# Altium schematic sheet MotorCell.SchDoc
size A3
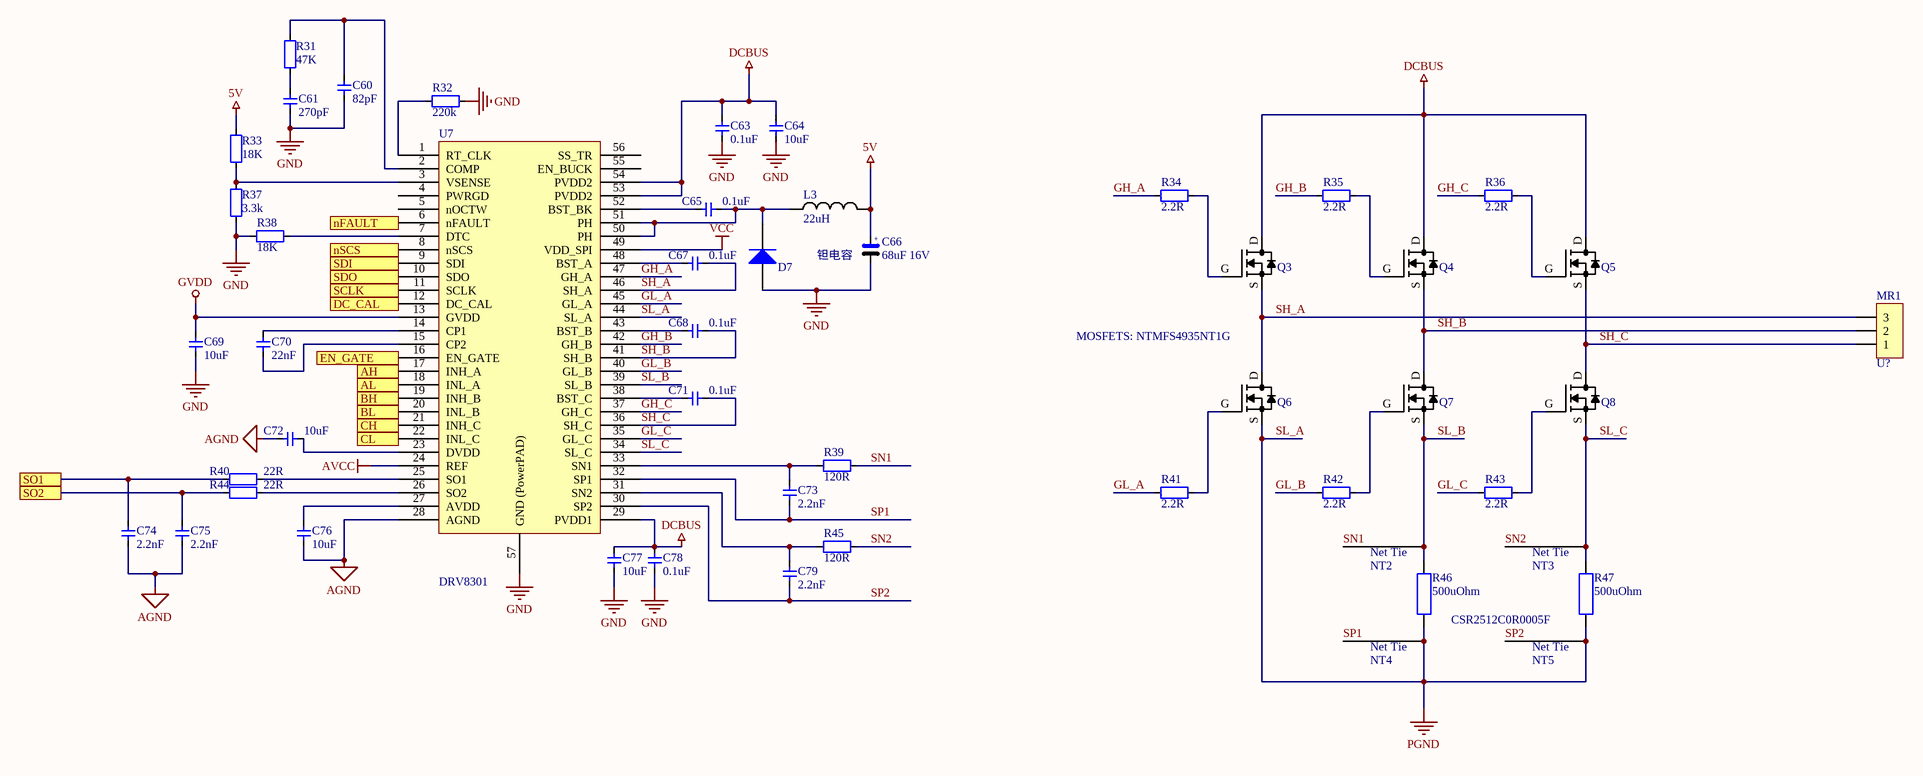
[diagram p0: MotorCell.SchDoc]

## Parts
C60  82pF  [CAP_0402]
C61  270pF  [CAP_0402]
C63  0.1uF  [CAP_0603]
C64  10uF  [CAP_0603]
C65  0.1uF  [CAP_0402]
C66  68uF 16V  [CAPCP6032X28N]
C67  0.1uF  [CAP_0603]
C68  0.1uF  [CAP_0603]
C69  10uF  [CAP_0402]
C70  22nF  [CAP_0402]
C71  0.1uF  [CAP_0603]
C72  10uF  [CAP_0402]
C73  2.2nF  [CAP_0402]
C74  2.2nF  [CAP_0402]
C75  2.2nF  [CAP_0402]
C76  10uF  [CAP_0402]
C77  10uF  [CAP_0603]
C78  0.1uF  [CAP_0603]
C79  2.2nF  [CAP_0402]
D7  MBR140SFT1G  [DIOM2717X10N]  (value not drawn)
L3  22uH  [INDC6060X28N]
MR1  U?  [MR30PW-M]
NT2  0.25mm  [NetTie_0.25mm]  (value not drawn)  (net tie, no BOM)
NT3  0.25mm  [NetTie_0.25mm]  (value not drawn)  (net tie, no BOM)
NT4  0.25mm  [NetTie_0.25mm]  (value not drawn)  (net tie, no BOM)
NT5  0.25mm  [NetTie_0.25mm]  (value not drawn)  (net tie, no BOM)
Q3  NTMFS4935NT1G  [SO8FL]  (value not drawn)
Q4  NTMFS4935NT1G  [SO8FL]  (value not drawn)
Q5  NTMFS4935NT1G  [SO8FL]  (value not drawn)
Q6  NTMFS4935NT1G  [SO8FL]  (value not drawn)
Q7  NTMFS4935NT1G  [SO8FL]  (value not drawn)
Q8  NTMFS4935NT1G  [SO8FL]  (value not drawn)
R31  47K  [RES_0402]
R32  220k  [RES_0402]
R33  18K  [RES_0402]
R34  2.2R  [RES_0402]
R35  2.2R  [RES_0402]
R36  2.2R  [RES_0402]
R37  3.3k  [RES_0402]
R38  18K  [RES_0402]
R39  120R  [RES_0402]
R40  22R  [RES_0402]
R41  2.2R  [RES_0402]
R42  2.2R  [RES_0402]
R43  2.2R  [RES_0402]
R44  22R  [RES_0402]
R45  120R  [RES_0402]
R46  value 500uOhm  [RESC6432X09N]  (hidden comment: CSR2512C0R0005F)
R47  value 500uOhm  [RESC6432X09N]  (hidden comment: CSR2512C0R0005F)
U7  DRV8301  [TSSOP50P810X120_HS-57N]

## Ports
AH, AL, BH, BL, CH, CL, DC_CAL, EN_GATE, nFAULT, nSCS, SCLK, SDI, SDO, SO1, SO2

## Nets
5V: C66.1 L3.2 R33.2
AGND: C72.2 C74.1 C75.1 C76.1 U7.28(AGND)
AVCC: U7.24(REF)
DCBUS: C63.2 C64.2 C77.2 C78.2 Q3.D Q4.D Q5.D U7.29(PVDD1) U7.53(PVDD2) U7.54(PVDD2)
GND: C60.2 C61.2 C63.1 C64.1 C66.2 C69.1 C77.1 C78.1 D7.A R32.1 R37.1 R38.1 U7.57(GND_(PowerPAD))
GVDD: C69.2 U7.13(GVDD)
SL_A: NT4.2 NT5.2 Q6.S R46.1 R47.1 U7.44(SL_A)  [also labelled PGND]
VCC: U7.49(VDD_SPI)
AH: U7.17(INH_A) ; port AH
AL: U7.18(INL_A) ; port AL
BH: U7.19(INH_B) ; port BH
BL: U7.20(INL_B) ; port BL
CH: U7.21(INH_C) ; port CH
CL: U7.22(INL_C) ; port CL
DC_CAL: U7.12(DC_CAL) ; port DC_CAL
EN_GATE: U7.16(EN_GATE) ; port EN_GATE
GH_A: R34.1 U7.47(GH_A)
GH_B: R35.1 U7.42(GH_B)
GH_C: R36.1 U7.37(GH_C)
GL_A: R41.1 U7.45(GL_A)
GL_B: R42.1 U7.40(GL_B)
GL_C: R43.1 U7.35(GL_C)
nFAULT: U7.6(nFAULT) ; port nFAULT
nSCS: U7.8(nSCS) ; port nSCS
SCLK: U7.11(SCLK) ; port SCLK
SDI: U7.9(SDI) ; port SDI
SDO: U7.10(SDO) ; port SDO
SH_A: C67.2 MR1.3 Q3.S Q6.D U7.46(SH_A)
SH_B: C68.2 MR1.2 Q4.S Q7.D U7.41(SH_B)
SH_C: C71.2 MR1.1 Q5.S Q8.D U7.36(SH_C)
SL_B: NT2.2 Q7.S R46.2 U7.39(SL_B)
SL_C: NT3.2 Q8.S R47.2 U7.34(SL_C)
SN1: NT2.1 R39.2
SN2: NT3.1 R45.2
SO1: C74.2 R40.1 ; port SO1
SO2: C75.2 R44.1 ; port SO2
SP1: C73.1 NT4.1 U7.32(SP1)
SP2: C79.1 NT5.1 U7.30(SP2)
NetC60_1: C60.1 R31.2 U7.2(COMP)
NetC61_1: C61.1 R31.1
NetC65_1: C65.1 D7.K L3.1 U7.50(PH) U7.51(PH)
NetC65_2: C65.2 U7.52(BST_BK)
NetC67_1: C67.1 U7.48(BST_A)
NetC68_1: C68.1 U7.43(BST_B)
NetC70_1: C70.1 U7.14(CP1)
NetC70_2: C70.2 U7.15(CP2)
NetC71_1: C71.1 U7.38(BST_C)
NetC72_1: C72.1 U7.23(DVDD)
NetC73_2: C73.2 R39.1 U7.33(SN1)
NetC76_2: C76.2 U7.27(AVDD)
NetC79_2: C79.2 R45.1 U7.31(SN2)
NetQ3_G: Q3.G R34.2
NetQ4_G: Q4.G R35.2
NetQ5_G: Q5.G R36.2
NetQ6_G: Q6.G R41.2
NetQ7_G: Q7.G R42.2
NetQ8_G: Q8.G R43.2
NetR32_2: R32.2 U7.1(RT_CLK)
NetR33_1: R33.1 R37.2 U7.3(VSENSE)
NetR38_2: R38.2 U7.7(DTC)
NetR40_2: R40.2 U7.25(SO1)
NetR44_2: R44.2 U7.26(SO2)

Not connected (* = marked no-connect by the designer): U7 4(PWRGD) 5(nOCTW) 55(EN_BUCK) 56(SS_TR)

## Notes on the sheet
- 钽电容
- MOSFETS: NTMFS4935NT1G
- (near NT5) CSR2512C0R0005F
- (in symbol NetTie_0.25mm) Net Tie
- (in symbol 钽电容) +

## Library data of the parts
C60 C61 C65 C69 C70 C72-C76 C79 = 电容-0402: Capacitor; Value: 0.1u
C63 C64 C67 C68 C71 C77 C78 = 电容-0603: Capacitor; Value: 0.1u
C66 = 钽电容
D7 = MBR140SFT1G: Rectifier Diode, Single, 40 V, 1 A, SOD-123FL, 2, 550 mV
L3 = NR6028T220M: INDUCTOR 22UH 1.4A 175.5 MOHM; Value: 22uH
MR1 = MR30PW-M: MR30PW-M 三芯
NT2-NT5 = NetTie_0.25mm
Q3-Q8 = NTMFS4935NT1G: MOSFET N-CH 30V 13A SO8FL; Manufacturer: ON Semiconductor; FET Type: N-Channel; Current - Continuous Drain (Id) @ 25°C: 13A (Ta), 93A (Tc); Drive Voltage (Max Rds On,  Min Rds On): 4.5V, 10V; Vgs(th) (Max) @ Id: 2.2V @ 250µA; Gate Charge (Qg) (Max) @ Vgs: 49.4nC @ 10V; Input Capacitance (Ciss) (Max) @ Vds: 4850pF @ 15V; Vgs (Max): ±20V; Power Dissipation (Max): 930mW (Ta), 48W (Tc); Rds On (Max) @ Id, Vgs: 3.2 mOhm @ 30A, 10V; Supplier 1: Digi-Key; Supplier Part Number 1: NTMFS4935NT1GOSCT-ND; RoHS: RoHS Compliant; Category: Discrete Semiconductor Products; Stock 1: 932; Pricing 1: 1=0.61, 10=0.541, 100=0.4145, 500=0.3277 (USD); Packaging: Cut Tape (CT); Part Status: Active; Technology: MOSFET (Metal Oxide); Drain to Source Voltage (Vdss): 30V; FET Feature: -; Operating Temperature: -55°C ~ 150°C (TJ); Mounting Type: Surface Mount; Supplier Device Package: 5-DFN (5x6) (8-SOFL); Package / Case: 8-PowerTDFN, 5 Leads; ComponentLink1URL: http://www.onsemi.com/pub_link/Collateral/NTMFS4935N-D.PDF; ComponentLink1Description: http://www.onsemi.com/pub_link/Collateral/NTMFS4935N-D.PDF; Manufacturer Part Number: NTMFS4935NT1G
R31-R39 R41-R43 R45 = 电阻-0402: Resistor; Value: 22R
R40 R44 = 电阻-0402: Resistor; Value: 22R
R46 R47 = CSR2512C0R0005F: RES SMD 0.0005 OHM 1% 3W 2512; Manufacturer: Riedon; Temperature Coefficient: ±100ppm/°C; Supplier 1: Digi-Key; Supplier Part Number 1: 696-1183-2-ND; RoHS: RoHS Compliant; Category: Resistors; Stock: 2000; Pricing 1: 2000=0.19817, 6000=0.1937, 10000=0.187, 50000=0.18148 (USD); Packaging: Tape & Reel (TR); Part Status: Active; Tolerance: ±1%; Power (Watts): 3W; Composition: Metal Element; Features: Current Sense; Operating Temperature: -55°C ~ 170°C; Package / Case: 2512 (6432 Metric); Supplier Device Package: 2512; Size / Dimension: 0.250" L x 0.118" W (6.35mm x 3.00mm); Height - Seated (Max): 0.057" (1.45mm); Failure Rate: -; ComponentLink1URL: http://riedon.com/media/pdf/CSR.pdf; ComponentLink1Description: http://riedon.com/media/pdf/CSR.pdf; Supplier 2: Digi-Key; Supplier Part Number 2: 696-1183-1-ND; Pricing 2: 1=0.69, 10=0.574, 25=0.4916, 50=0.4426, 100=0.3852, 250=0.3442, 500=0.27864, 1000=0.22536 (USD); Manufacturer Part Number: CSR2512C0R0005F
U7 = DRV8301: MOTOR DRIVER, 3PH, 56HTSSOP